# Altium schematic sheet Power.SchDoc
size A; DocumentNumber: 2; SheetNumber: 2; SheetTotal: 5
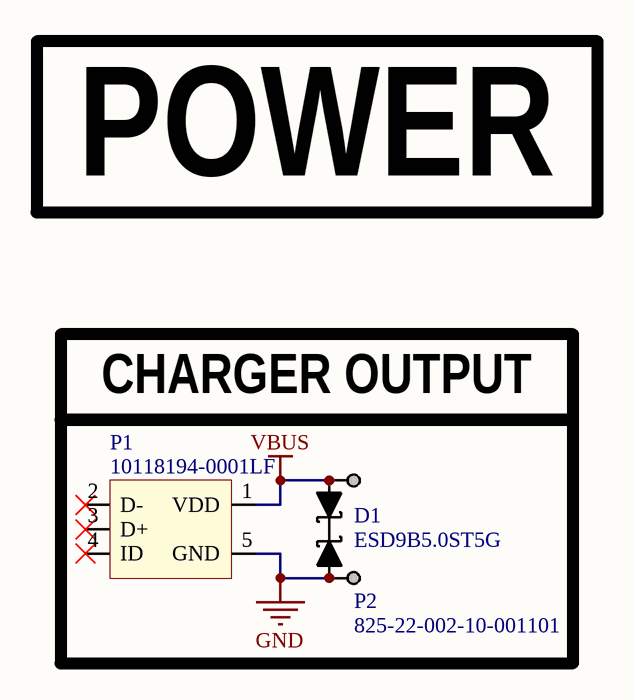
[diagram p0: Power.SchDoc]

## Parts
D1  ESD9B5.0ST5G  [ESD9B5.0ST5G]
P1  10118194-0001LF  [10118194-0001LF]
P2  825-22-002-10-001101  [825-22-002-10-001101]

## Blocks framed on the sheet
CHARGER OUTPUT: D1 P1 P2

## Nets
GND: D1.1 P1.5(GND) P2.2
VBUS: D1.2 P1.1(VDD) P2.1

Not connected (* = marked no-connect by the designer): P1 2(D-)* 3(D+)* 4(ID)*

## Notes on the sheet
- POWER

## Library data of the parts
D1 = ESD9B5.0ST5G: TVS DIODE 5V SOD923
P1 = 10118194-0001LF: 10118194-0001LF USB - micro B USB 2.0 Receptacle Connector 5 Position Surface Mount, Right Angle; Through Hole
P2 = 825-22-002-10-001101: 2 Position Spring Piston Connector Through Hole